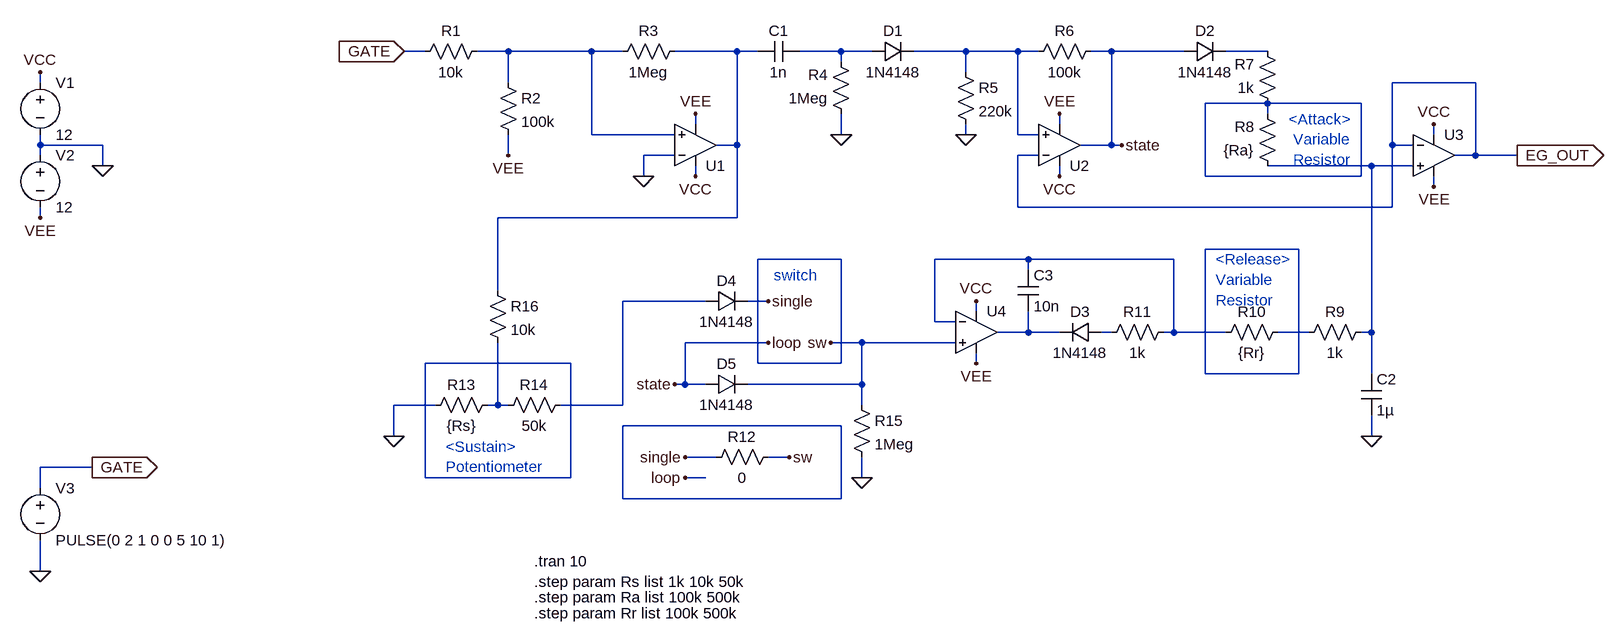
[diagram p0: schematic adsr_envelope_generator_2.asc]
adsr_envelope_generator_2.asc, the LTspice schematic file:
Version 4
SHEET 1 2004 940
WIRE 0 48 -32 48
WIRE 128 48 80 48
WIRE 256 48 128 48
WIRE 304 48 256 48
WIRE 480 48 384 48
WIRE 512 48 480 48
WIRE 640 48 576 48
WIRE 688 48 640 48
WIRE 832 48 752 48
WIRE 912 48 832 48
WIRE 944 48 912 48
WIRE 1056 48 1024 48
WIRE 1168 48 1056 48
WIRE 1296 48 1232 48
WIRE 640 64 640 48
WIRE 832 80 832 48
WIRE -592 96 -592 80
WIRE 128 96 128 48
WIRE 1616 96 1488 96
WIRE 1296 128 1200 128
WIRE 1440 128 1296 128
WIRE 1296 144 1296 128
WIRE 416 160 416 144
WIRE 976 160 976 144
WIRE 256 176 256 48
WIRE 384 176 256 176
WIRE 640 176 640 144
WIRE 832 176 832 160
WIRE 912 176 912 48
WIRE 944 176 912 176
WIRE 1552 176 1552 160
WIRE -592 192 -592 176
WIRE -496 192 -592 192
WIRE 480 192 480 48
WIRE 480 192 448 192
WIRE 1056 192 1056 48
WIRE 1056 192 1008 192
WIRE 1072 192 1056 192
WIRE 1488 192 1488 96
WIRE 1520 192 1488 192
WIRE -592 208 -592 192
WIRE 128 208 128 176
WIRE 384 208 336 208
WIRE 944 208 912 208
WIRE 1616 208 1616 96
WIRE 1616 208 1584 208
WIRE 1680 208 1616 208
WIRE -496 224 -496 192
WIRE 1456 224 1296 224
WIRE 1520 224 1456 224
WIRE 336 240 336 208
WIRE 416 240 416 224
WIRE 976 240 976 224
WIRE 1200 240 1200 128
WIRE 1440 240 1440 128
WIRE 1440 240 1200 240
WIRE 1552 256 1552 240
WIRE 912 288 912 208
WIRE 1488 288 1488 192
WIRE 1488 288 912 288
WIRE -592 304 -592 288
WIRE 480 304 480 192
WIRE 480 304 112 304
WIRE 1344 352 1200 352
WIRE 640 368 512 368
WIRE 928 368 784 368
WIRE 1152 368 928 368
WIRE 928 384 928 368
WIRE 112 416 112 304
WIRE 432 432 304 432
WIRE 528 432 496 432
WIRE 848 448 848 432
WIRE 784 464 784 368
WIRE 816 464 784 464
WIRE 928 480 928 448
WIRE 928 480 880 480
WIRE 976 480 928 480
WIRE 1056 480 1040 480
WIRE 1152 480 1152 368
WIRE 1152 480 1136 480
WIRE 1232 480 1152 480
WIRE 1360 480 1312 480
WIRE 1456 480 1456 224
WIRE 1456 480 1440 480
WIRE 528 496 400 496
WIRE 672 496 624 496
WIRE 816 496 672 496
WIRE 224 528 0 528
WIRE 512 528 512 368
WIRE 640 528 640 368
WIRE 640 528 512 528
WIRE 848 528 848 512
WIRE 1200 544 1200 352
WIRE 1344 544 1344 352
WIRE 1344 544 1200 544
WIRE 1456 544 1456 480
WIRE 400 560 400 496
WIRE 400 560 384 560
WIRE 432 560 400 560
WIRE 672 560 672 496
WIRE 672 560 496 560
WIRE 16 592 -48 592
WIRE 112 592 112 496
WIRE 112 592 96 592
WIRE 128 592 112 592
WIRE 304 592 304 432
WIRE 304 592 208 592
WIRE 672 592 672 560
WIRE 640 624 304 624
WIRE -48 640 -48 592
WIRE 1456 640 1456 608
WIRE 448 672 400 672
WIRE 560 672 528 672
WIRE -512 688 -592 688
WIRE 0 704 0 528
WIRE 224 704 224 528
WIRE 224 704 0 704
WIRE 432 704 400 704
WIRE 672 704 672 672
WIRE -592 720 -592 688
WIRE 304 736 304 624
WIRE 640 736 640 624
WIRE 640 736 304 736
WIRE -592 848 -592 800
FLAG -592 80 VCC
FLAG -592 304 VEE
FLAG -496 224 0
FLAG 416 240 VCC
FLAG 416 144 VEE
FLAG 336 240 0
FLAG 128 208 VEE
FLAG -32 48 GATE
IOPIN -32 48 In
FLAG 640 176 0
FLAG 976 240 VCC
FLAG 976 144 VEE
FLAG 832 176 0
FLAG 1552 160 VCC
FLAG 1552 256 VEE
FLAG 1680 208 EG_OUT
IOPIN 1680 208 Out
FLAG 1456 640 0
FLAG 848 432 VCC
FLAG 848 528 VEE
FLAG 1072 192 state
FLAG 384 560 state
FLAG 528 496 loop
FLAG 528 432 single
FLAG 624 496 sw
FLAG 400 672 single
FLAG 400 704 loop
FLAG 560 672 sw
FLAG -48 640 0
FLAG -512 688 GATE
IOPIN -512 688 Out
FLAG -592 848 0
FLAG 672 704 0
SYMBOL OpAmps\\UniversalOpAmp2 416 192 M180
SYMATTR InstName U1
SYMBOL voltage -592 80 R0
SYMATTR InstName V1
SYMATTR Value 12
SYMBOL voltage -592 192 R0
SYMATTR InstName V2
SYMATTR Value 12
SYMBOL res 96 32 R90
WINDOW 0 0 56 VBottom 2
WINDOW 3 32 56 VTop 2
SYMATTR InstName R1
SYMATTR Value 10k
SYMBOL res 112 80 R0
SYMATTR InstName R2
SYMATTR Value 100k
SYMBOL res 400 32 R90
WINDOW 0 0 56 VBottom 2
WINDOW 3 32 56 VTop 2
SYMATTR InstName R3
SYMATTR Value 1Meg
SYMBOL cap 576 32 R90
WINDOW 0 0 32 VBottom 2
WINDOW 3 32 32 VTop 2
SYMATTR InstName C1
SYMATTR Value 1n
SYMBOL res 656 160 R180
WINDOW 0 36 76 Left 2
WINDOW 3 36 40 Left 2
SYMATTR InstName R4
SYMATTR Value 1Meg
SYMBOL diode 688 64 R270
WINDOW 0 32 32 VTop 2
WINDOW 3 0 32 VBottom 2
SYMATTR InstName D1
SYMATTR Value 1N4148
SYMBOL OpAmps\\UniversalOpAmp2 976 192 M180
SYMATTR InstName U2
SYMBOL res 816 64 R0
SYMATTR InstName R5
SYMATTR Value 220k
SYMBOL res 1040 32 R90
WINDOW 0 0 56 VBottom 2
WINDOW 3 32 56 VTop 2
SYMATTR InstName R6
SYMATTR Value 100k
SYMBOL diode 1168 64 R270
WINDOW 0 32 32 VTop 2
WINDOW 3 0 32 VBottom 2
SYMATTR InstName D2
SYMATTR Value 1N4148
SYMBOL res 1312 144 R180
WINDOW 0 36 76 Left 2
WINDOW 3 36 40 Left 2
SYMATTR InstName R7
SYMATTR Value 1k
SYMBOL res 1312 240 R180
WINDOW 0 36 76 Left 2
WINDOW 3 36 40 Left 2
SYMATTR InstName R8
SYMATTR Value {Ra}
SYMBOL OpAmps\\UniversalOpAmp2 1552 208 R0
SYMATTR InstName U3
SYMBOL cap 1440 544 R0
SYMATTR InstName C2
SYMATTR Value 1µ
SYMBOL res 1456 464 R90
WINDOW 0 0 56 VBottom 2
WINDOW 3 32 56 VTop 2
SYMATTR InstName R9
SYMATTR Value 1k
SYMBOL res 1216 496 R270
WINDOW 0 32 56 VTop 2
WINDOW 3 0 56 VBottom 2
SYMATTR InstName R10
SYMATTR Value {Rr}
SYMBOL res 1152 464 R90
WINDOW 0 0 56 VBottom 2
WINDOW 3 32 56 VTop 2
SYMATTR InstName R11
SYMATTR Value 1k
SYMBOL diode 1040 464 R90
WINDOW 0 0 32 VBottom 2
WINDOW 3 32 32 VTop 2
SYMATTR InstName D3
SYMATTR Value 1N4148
SYMBOL cap 912 384 R0
SYMATTR InstName C3
SYMATTR Value 10n
SYMBOL OpAmps\\UniversalOpAmp2 848 480 R0
SYMATTR InstName U4
SYMBOL diode 432 448 R270
WINDOW 0 32 32 VTop 2
WINDOW 3 0 32 VBottom 2
SYMATTR InstName D4
SYMATTR Value 1N4148
SYMBOL diode 432 576 R270
WINDOW 0 32 32 VTop 2
WINDOW 3 0 32 VBottom 2
SYMATTR InstName D5
SYMATTR Value 1N4148
SYMBOL res 544 656 R90
WINDOW 0 0 56 VBottom 2
WINDOW 3 32 56 VTop 2
SYMATTR InstName R12
SYMATTR Value 0
SYMBOL res 112 576 R90
WINDOW 0 0 56 VBottom 2
WINDOW 3 32 56 VTop 2
SYMATTR InstName R13
SYMATTR Value {Rs}
SYMBOL res 224 576 R90
WINDOW 0 0 56 VBottom 2
WINDOW 3 32 56 VTop 2
SYMATTR InstName R14
SYMATTR Value 50k
SYMBOL voltage -592 704 R0
WINDOW 123 0 0 Left 0
WINDOW 39 0 0 Left 0
SYMATTR InstName V3
SYMATTR Value PULSE(0 2 1 0 0 5 10 1)
SYMBOL res 656 576 R0
SYMATTR InstName R15
SYMATTR Value 1Meg
SYMBOL res 96 400 R0
SYMATTR InstName R16
SYMATTR Value 10k
TEXT 1424 152 Right 2 ;<Attack>\nVariable\nResistor
TEXT 1216 368 Left 2 ;<Release>\nVariable\nResistor
TEXT 536 392 Left 2 ;switch
TEXT 168 832 Left 2 !.tran 10
TEXT 32 656 Left 2 ;<Sustain>\nPotentiometer
TEXT 168 864 Left 2 !.step param Rs list 1k 10k 50k
TEXT 168 888 Left 2 !.step param Ra list 100k 500k
TEXT 168 912 Left 2 !.step param Rr list 100k 500k

The netlist it stands for:
* adsr_envelope_generator_2.asc
XU1 N001 0 VCC VEE N002 level2 Avol=1Meg GBW=10Meg Slew=10Meg Ilimit=25m Rail=0 Vos=0 En=0 Enk=0 In=0 Ink=0 Rin=500Meg  ; pins In+ In- V+ V- OUT
V1 VCC 0 12
V2 0 VEE 12
R1 N001 GATE 10k
R2 N001 VEE 100k
R3 N002 N001 1Meg
C1 N003 N002 1n
R4 0 N003 1Meg
D1 N003 N004 1N4148
XU2 N004 EG_OUT VCC VEE loop level2 Avol=1Meg GBW=10Meg Slew=10Meg Ilimit=25m Rail=0 Vos=0 En=0 Enk=0 In=0 Ink=0 Rin=500Meg  ; pins In+ In- V+ V- OUT
R5 N004 0 220k
R6 loop N004 100k
D2 loop N005 1N4148
R7 N006 N005 1k
R8 N007 N006 {Ra}
XU3 N007 EG_OUT VCC VEE EG_OUT level2 Avol=1Meg GBW=10Meg Slew=10Meg Ilimit=25m Rail=0 Vos=0 En=0 Enk=0 In=0 Ink=0 Rin=500Meg  ; pins In+ In- V+ V- OUT
C2 N007 0 1µ
R9 N007 N014 1k
R10 N010 N014 {Rr}
R11 N010 N013 1k
D3 N013 N012 1N4148
C3 N010 N012 10n
XU4 sw N010 VCC VEE N012 level2 Avol=1Meg GBW=10Meg Slew=10Meg Ilimit=25m Rail=0 Vos=0 En=0 Enk=0 In=0 Ink=0 Rin=500Meg  ; pins In+ In- V+ V- OUT
D4 N011 single 1N4148
D5 loop sw 1N4148
R12 sw single 0
R13 N016 0 {Rs}
R14 N011 N016 50k
V3 GATE 0 PULSE(0 2 1 0 0 5 10 1)
R15 sw 0 1Meg
R16 N002 N016 10k
.model D D
.lib standard.dio
* <Attack>
* Variable
* Resistor
* <Release>
* Variable
* Resistor
* switch
.tran 10
* <Sustain>
* Potentiometer
.step param Rs list 1k 10k 50k
.step param Ra list 100k 500k
.step param Rr list 100k 500k
.lib UniversalOpAmp2.lib
.backanno
.end